# Altium schematic sheet Kill_Switch_Testing.SchDoc
size A
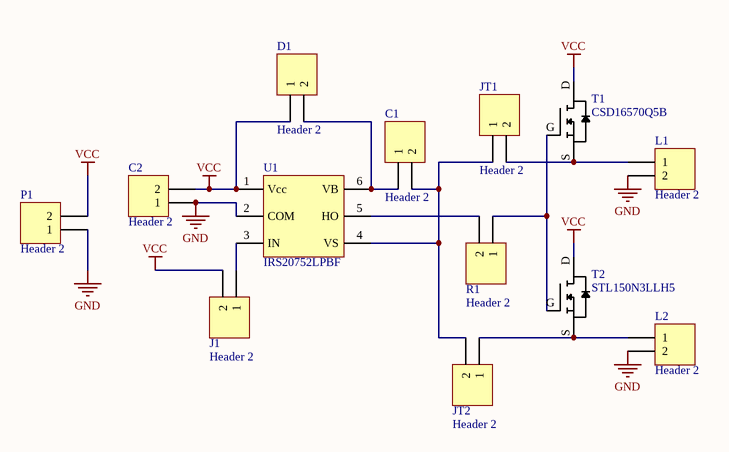
[diagram p0: Kill_Switch_Testing.SchDoc]

## Parts
C1  Header 2  [HDR1X2]
C2  Header 2  [HDR1X2]
D1  Header 2  [HDR1X2]
J1  Header 2  [HDR1X2]
JT1  Header 2  [HDR1X2]
JT2  Header 2  [HDR1X2]
L1  Header 2  [HDR1X2]
L2  Header 2  [HDR1X2]
P1  Header 2  [HDR1X2]
R1  Header 2  [HDR1X2]
T1  CSD16570Q5B  [CSD16570Q5B]
T2  STL150N3LLH5  [STL150N3LLH5]
U1  IRS20752LPBF  [IRS20752LPBF]

## Nets
GND: C2.1 L1.2 L2.2 P1.1 U1.2(COM)
VCC: C2.2 D1.1 J1.2 P1.2 T1.D(Drain) T2.D(Drain) U1.1(Vcc)
NetC1_1: C1.1 D1.2 U1.6(VB)
NetC1_2: C1.2 JT1.1 JT2.2 U1.4(VS)
NetJ1_1: J1.1 U1.3(IN)
NetJT1_2: JT1.2 L1.1 T1.S(Source)
NetJT2_1: JT2.1 L2.1 T2.S(Source)
NetR1_1: R1.1 T1.G(Gate) T2.G(Gate)
NetR1_2: R1.2 U1.5(HO)

## Library data of the parts
C1 C2 D1 J1 JT1 JT2 L1 L2 P1 R1 = Header 2: Header, 2-Pin; LatestRevisionDate: 17-Jul-2002; LatestRevisionNote: Re-released for DXP Platform.; Publisher: Altium Limited
T1 = CSD16570Q5B: 25-V N-Channel NexFET™ Power MOSFET
T2 = STL150N3LLH5: N-channel 30 V, 0.0014 Ω typ., 35 A STripFET™ V Power MOSFET
U1 = IRS20752LPBF: SOT-23 High-Side Gate Driver IC